# EAGLE design gismovii (EAGLE 7.4.0)
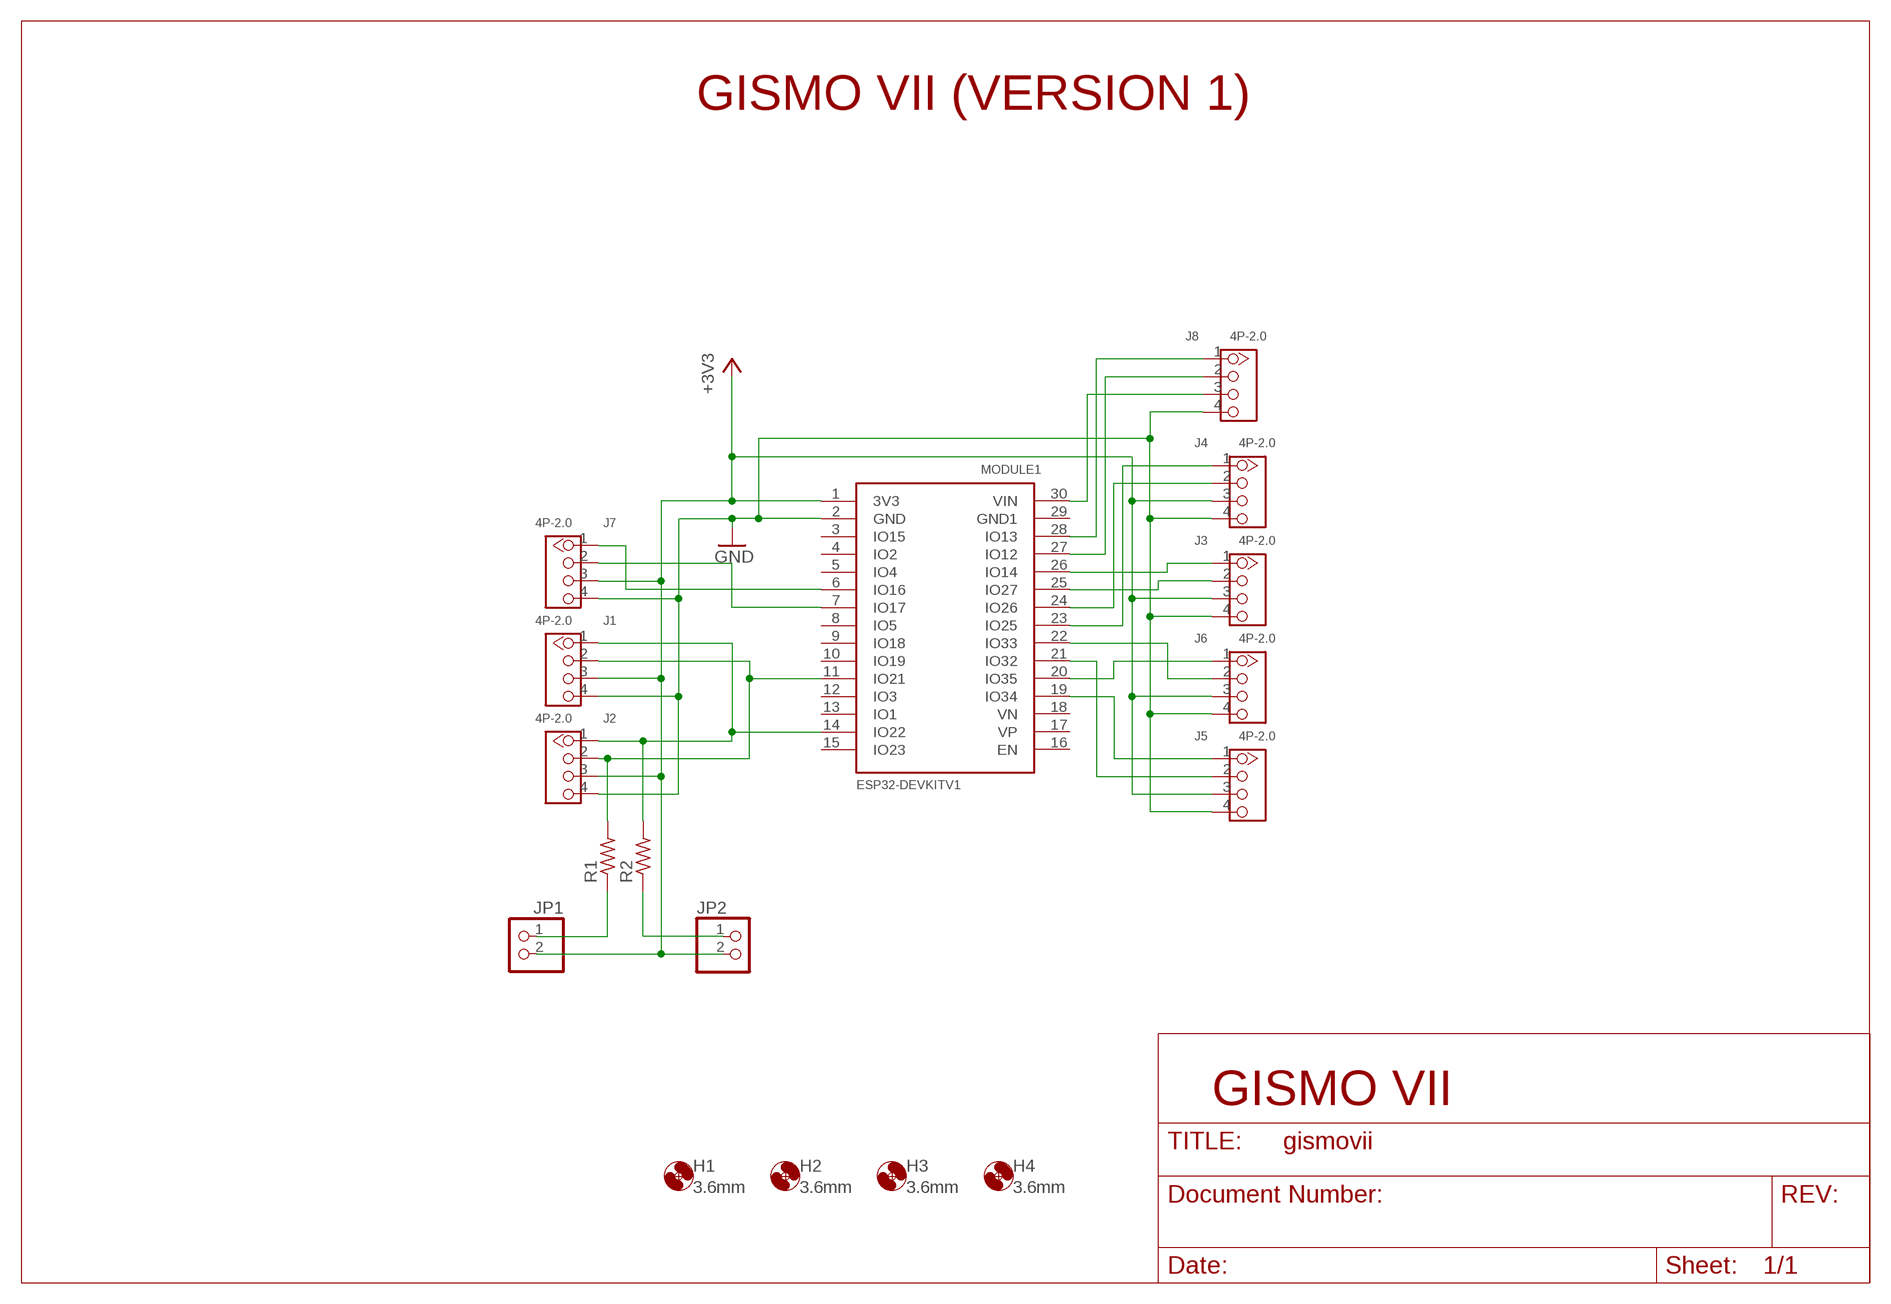
[diagram p0: schematic, sheet 1]

## Parts
H1  3.6mm  MOUNT-HOLE3.6  [3,6]
H2  3.6mm  MOUNT-HOLE3.6  [3,6]
H3  3.6mm  MOUNT-HOLE3.6  [3,6]
H4  3.6mm  MOUNT-HOLE3.6  [3,6]
J1  4P-2.0  GROVE-CONNECTOR-DIP(4P-2.0)  [HW4-2.0]
J2  4P-2.0  GROVE-CONNECTOR-DIP(4P-2.0)  [HW4-2.0]
J3  4P-2.0  GROVE-CONNECTOR-DIP(4P-2.0)  [HW4-2.0]
J4  4P-2.0  GROVE-CONNECTOR-DIP(4P-2.0)  [HW4-2.0]
J5  4P-2.0  GROVE-CONNECTOR-DIP(4P-2.0)  [HW4-2.0]
J6  4P-2.0  GROVE-CONNECTOR-DIP(4P-2.0)  [HW4-2.0]
J7  4P-2.0  GROVE-CONNECTOR-DIP(4P-2.0)  [HW4-2.0]
J8  4P-2.0  GROVE-CONNECTOR-DIP(4P-2.0)  [HW4-2.0]
JP1  PINHD-1X2  [1X02]
JP2  PINHD-1X2  [1X02]
MODULE1  ESP32DEVKITV1  [ESP32-DEVKITV1]
R1  R-US_0204/7  [0204/7]
R2  R-US_0204/7  [0204/7]

## Nets
+3V3: J1.3 J2.3 J3.3 J4.3 J5.3 J6.3 J7.3 JP1.2 JP2.2 MODULE1.1(3V3)
GND: J1.4 J2.4 J3.4 J4.4 J5.4 J6.4 J7.4 J8.4 MODULE1.2(GND)
N$1: J1.2 J2.2 MODULE1.11(IO21) R1.2
N$2: J1.1 J2.1 MODULE1.14(IO22) R2.2
N$3: J7.2 MODULE1.7(IO17)
N$4: J7.1 MODULE1.6(IO16)
N$5: J5.1 MODULE1.19(IO34)
N$6: J4.2 MODULE1.24(IO26)
N$7: J4.1 MODULE1.23(IO25)
N$8: J3.1 MODULE1.26(IO14)
N$9: J3.2 MODULE1.25(IO27)
N$11: J6.1 MODULE1.20(IO35)
N$12: J6.2 MODULE1.22(IO33)
N$13: JP2.1 R2.1
N$14: JP1.1 R1.1
N$15: J5.2 MODULE1.21(IO32)
N$16: J8.3 MODULE1.30(VIN)
N$17: J8.2 MODULE1.27(IO12)
N$18: J8.1 MODULE1.28(IO13)
Unconnected: MODULE1.3(IO15) MODULE1.4(IO2) MODULE1.5(IO4) MODULE1.8(IO5) MODULE1.9(IO18) MODULE1.10(IO19) MODULE1.12(IO3) MODULE1.13(IO1) MODULE1.15(IO23) MODULE1.16(EN) MODULE1.17(VP) MODULE1.18(VN) MODULE1.29(GND1)

## Notes on the sheet
- GISMO VII (VERSION 1)
- GISMO VII

## Library data of the parts
H1-H4 = holes:MOUNT-HOLE: MOUNTING HOLE with drill center marker
J1-J8 = OPL_Connector:GROVE-CONNECTOR-DIP(4P-2.0): 320110033
JP1 JP2 = pinhead:PINHD-1X2: PIN HEADER
MODULE1 = ESP32-DEVKITV1:ESP32DEVKITV1
R1 R2 = rcl:R-US_: RESISTOR, American symbol

## Board
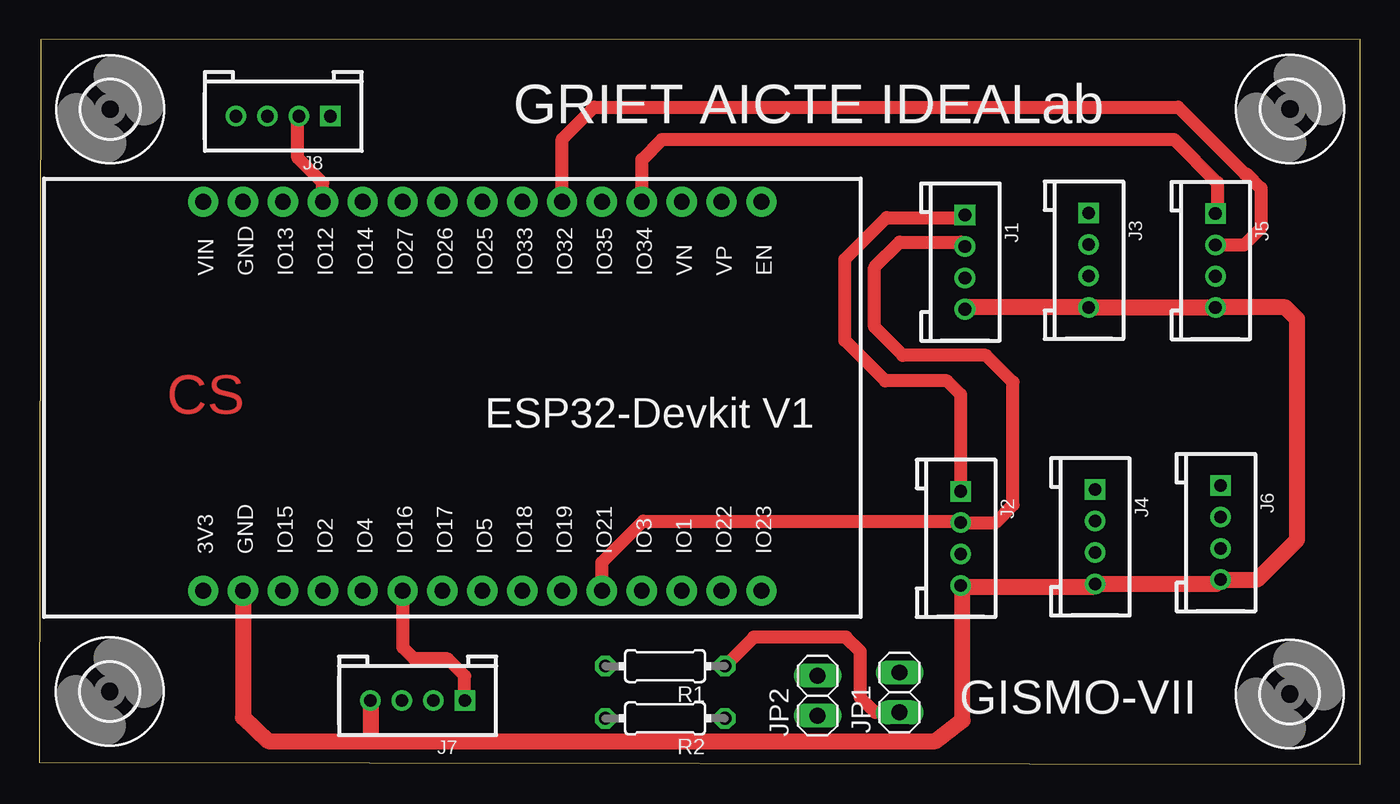
[diagram p1: board, top side]
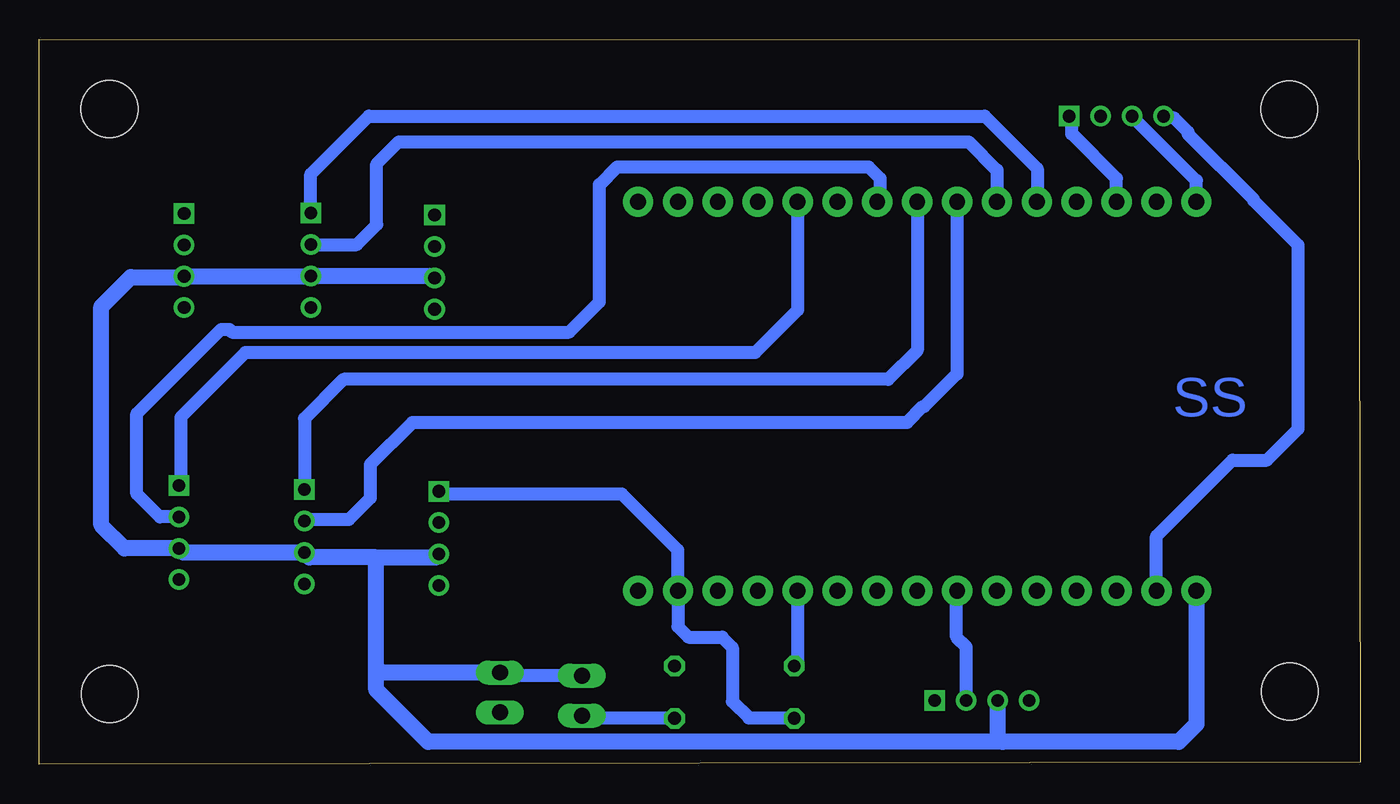
[diagram p2: board, bottom side, seen from below]

Size 84.14 x 46.17 mm. Coordinates in mm from the lower left corner, seen from the top.
Outline: 0,0.13 84.14,0 84.13,46.17 0.08,46.13 0,0.13
Copper layers (1*16): Top 0.035mm / dielectric 1.5mm / Bottom 0.035mm
Design rules "default *": minimum track width 10mil, minimum drill 24mil, track to track 8mil, track to pad 8mil, pad to pad 8mil, via to via 8mil, smd to smd 8mil, copper to edge 30mil, drill to drill 8mil, minimum pad ring 10mil, minimum via ring 8mil, stop-mask expansion 4mil, vias tented up to drill 0mil, thermal gap 10mil

### Footprints (pad centres in the part's own frame; a part is rotated, then mirrored left to right if it is on the bottom)
3,6 = hole 3.6: 0,0
HW4-2.0 = drill 0.8 pad 1.27 square: 1 -3,0 | drill 0.8 pad 1.27: 2 -1,0; 3 1,0; 4 3,0
1X02 = drill 1.016 long: 1 -1.27,0; 2 1.27,0
ESP32-DEVKITV1 = drill 1 pad 1.93: 1 -22.87,-13.54; 2 -20.33,-13.54; 3 -17.79,-13.54; 4 -15.25,-13.54; 5 -12.71,-13.54; 6 -10.17,-13.54; 7 -7.63,-13.54; 8 -5.09,-13.54; 9 -2.55,-13.54; 10 -0.01,-13.54; 11 2.53,-13.54; 12 5.07,-13.54; 13 7.61,-13.54; 14 10.15,-13.54; 15 12.69,-13.54; 16 12.69,11.23; 17 10.15,11.23; 18 7.61,11.23; 19 5.07,11.23; 20 2.53,11.23; 21 -0.01,11.23; 22 -2.55,11.23; 23 -5.09,11.23; 24 -7.63,11.23; 25 -10.17,11.23; 26 -12.71,11.23; 27 -15.25,11.23; 28 -17.79,11.23; 29 -20.33,11.23; 30 -22.87,11.23
0204/7 = drill 0.813 octagon: 1 -3.81,0; 2 3.81,0

### Placement (x,y rotation side)
H1  4.48,4.64 0 top
H2  79.67,41.73 0 top
H3  4.51,41.72 0 top
H4  79.64,4.48 0 top
J1  58.96,31.98 270 top
J2  58.69,14.39 270 top
J3  66.85,32.1 270 top
J4  67.24,14.49 270 top
J5  74.91,32.08 270 top
J6  75.24,14.76 270 top
J7  24.1,4.06 180 top
J8  15.54,41.27 180 top
JP1  54.8,4.58 90 top
JP2  49.58,4.38 90 top
MODULE1  33.31,24.6 0 top
R1  39.86,6.26 180 top
R2  39.86,2.93 180 top

### Tracks (layer width: path | path; a pad name or v marks a point on that pad's centre or on a via)
+3V3
  Bottom 0.813: JP2.2 54.6,5.65 JP1.2
  Bottom 1.016: MODULE1.1 10.44,2.56 11.56,1.44 22.77,1.44 | J1.3 59.08,31.1 J3.3 66.87,31.08 J5.3 74.96,31.03 78.3,31.03 80.18,29.15 80.18,15.24 78.7,13.76 J6.3 74.97,13.49 J4.3 66.93,13.18 62.67,13.18 | 22.77,1.44 59.37,1.44 62.67,4.74 62.67,6.18 | 62.67,6.18 62.67,13.18 | 62.67,13.18 58.9,13.18 J2.3 | JP1.2 62.34,5.85 62.67,6.18 | J7.3 23.1,1.77 22.77,1.44
GND
  Top 1.016: MODULE1.2 12.98,3 14.59,1.48 20.62,1.48 | 20.62,1.48 57.09,1.48 58.81,2.8 58.81,11.27 J2.4 58.77,11.31 67.06,11.31 J4.4 74.97,11.49 J6.4 77.57,11.76 80.12,14.31 80.12,28.35 79.37,29.1 74.93,29.1 J5.4 66.87,29.08 J3.4 59.08,29.1 J1.4 | J7.4 21.1,1.56 20.62,1.48
  Bottom 0.813: MODULE1.2 12.98,14.53 8.14,19.37 5.95,19.37 3.96,21.36 3.96,33.07 6.79,35.9 6.79,35.97 10.97,40.15 10.97,40.27 11.87,41.17 12.44,41.17 J8.4
N$1
  Top 0.813: MODULE1.11 35.84,12.87 38.46,15.49 58.59,15.49 J2.2 60.89,15.39 62.02,16.52 62.02,24.34 60.31,26.05 55.01,26.05 53.2,27.86 53.2,31.64 54.82,33.26 58.68,33.26 J1.2
  Bottom 0.813: MODULE1.11 35.84,6.47 R1.2
N$2
  Top 0.813: J2.1 58.69,23.55 57.82,24.42 53.89,24.42 51.31,27 51.31,32.15 53.97,34.81 58.79,34.81 J1.1
  Bottom 0.813: R2.2 36.08,2.96 38.95,2.96 39.99,4 39.99,7.44 40.65,8.1 42.79,8.1 43.46,8.77 MODULE1.14 43.46,13.64 47.03,17.21 58.51,17.21 J2.1
N$3
  Bottom 0.813: J7.2 25.1,7.49 25.71,8.1 25.71,11.03 MODULE1.7
N$4
  Top 0.813: J7.1 27.1,5.63 26.01,6.72 23.88,6.72 23.17,7.43 23.17,11.03 MODULE1.6
N$5
  Top 0.813: MODULE1.19 38.38,38.51 39.66,39.79 72.29,39.79 75.04,37.04 75.04,35.21 J5.1
N$6
  Bottom 0.813: MODULE1.24 25.68,24.87 27.76,22.79 27.84,22.79 28.87,21.76 60.39,21.76 63.05,19.1 63.05,16.95 64.42,15.58 67.15,15.58 J4.2
N$7
  Bottom 0.813: MODULE1.23 28.22,26.36 30.07,24.51 64.76,24.51 67.25,22.02 J4.1
N$8
  Bottom 0.813: J3.1 66.85,37.59 63.16,41.28 23.92,41.28 20.58,37.94 20.58,35.85 MODULE1.26
N$9
  Bottom 0.813: J3.2 63.92,33.1 62.65,34.37 62.65,38.23 61.24,39.64 24.94,39.64 23.13,37.83 MODULE1.25
N$11
  Bottom 0.813: MODULE1.20 35.84,28.93 38.55,26.22 71.01,26.22 75.13,22.1 75.13,17.87 J6.1
N$12
  Bottom 0.813: J6.2 76.46,15.76 77.92,17.22 77.92,22.33 72.55,27.7 72.04,27.7 71.87,27.53 50.38,27.53 48.46,29.45 48.46,36.92 47.33,38.05 31.32,38.05 30.59,37.32 30.59,36 MODULE1.22
N$13
  Bottom 0.813: R2.1 49.4,2.93 JP2.1
N$14
  Top 0.813: JP1.1 53.23,3.31 52.29,4.25 52.29,7.2 51.39,8.1 45.51,8.1 R1.1
N$15
  Top 0.813: MODULE1.21 33.3,39.81 35.34,41.85 72.54,41.85 76.79,37.6 76.9,37.6 77.81,36.69 77.81,34.15 76.73,33.07 J5.2
N$16
  Bottom 0.813: MODULE1.30 10.44,37.17 J8.3
N$17
  Top 0.813: MODULE1.27 18.06,37.02 16.46,38.62 16.46,41.19 J8.2
N$18
  Bottom 0.813: MODULE1.28 15.52,37.29 18.38,40.15 18.38,41.11 J8.1

### Text on the board
Top: CS
Bottom: SS
tNames: GRIET AICTE IDEALab | GISMO-VII